# Altium schematic sheet AD8367.SchDoc
size A4
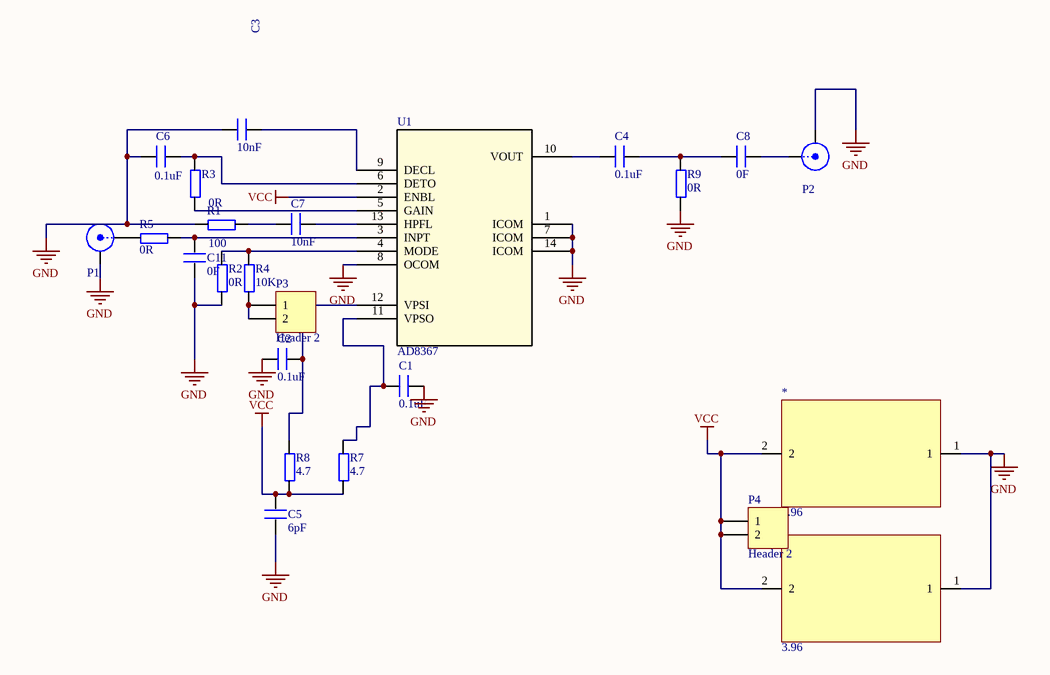
[diagram p0: AD8367.SchDoc]

## Parts
1  3.96  [3.96]
*  3.96  [3.96]
C1  0.1uF  [0603C]
C2  0.1uF  [0603C]
C3  10nF  [0603C]
C4  0.1uF  [0603C]
C5  6pF  [C 0805_M]
C6  0.1uF  [0603C]
C7  10nF  [0603C]
C8  0F  [0603C]
C11  0F  [0603C]
P1  SMA  [SMA-V]  (value not drawn)
P2  SMA  [SMA-V]  (value not drawn)
P3  Header 2  [HDR1X2]
P4  Header 2  [HDR1X2]
R1  100  [0603R]
R2  0R  [0603R]
R3  0R  [0603R]
R4  10K  [0603R]
R5  0R  [0603R]
R7  4.7  [0603R]
R8  4.7  [0603R]
R9  0R  [0603R]
U1  AD8367  [RU_14]

## Nets
GND: 1.1 *.1 C1.1 C2.2 C3.1 C5.1 C6.1 C11.2 P1.2(Y) P2.2(Y) R1.1 R2.1 R9.1 U1.1(ICOM) U1.7(ICOM) U1.8(OCOM) U1.14(ICOM)
VCC: 1.2 *.2 C5.2 P4.1 P4.2 R7.1 R8.1 U1.2(ENBL)
NetC1_2: C1.2 R7.2 U1.11(VPSO)
NetC2_1: C2.1 R8.2 U1.12(VPSI)
NetC3_2: C3.2 U1.9(DECL)
NetC4_1: C4.1 U1.10(VOUT)
NetC4_2: C4.2 C8.1 R9.2
NetC6_2: C6.2 R3.2 U1.6(DETO)
NetC7_1: C7.1 R1.2
NetC7_2: C7.2 U1.13(HPFL)
NetC8_2: C8.2 P2.1(X)
NetC11_1: C11.1 R5.2 U1.3(INPT)
NetP1_1: P1.1(X) R5.1
NetP3_1: P3.1 P3.2 R4.1
NetR2_2: R2.2 R4.2 U1.4(MODE)
NetR3_1: R3.1 U1.5(GAIN)

## Library data of the parts
C1-C8 C11 = C: Capacitor
P1 P2 = SMA: SMA Connector
P3 P4 = Header 2: Header, 2-Pin; LatestRevisionDate: 17-Jul-2002; LatestRevisionNote: Re-released for DXP Platform.; Publisher: Altium Limited
R1-R5 R7-R9 = Resistor
U1 = AD8367: 500 MHz 、45dB线性dB可变增益放大器; Manufacturer_Part_Number: AD8367ARUZ; Built_By: EMA_UL_Team; Vendor: Analog Devices Inc; Copyright: Copyright (C) 2018 Accelerated Designs. All rights reserved; RefDes: RefDes; Type: DEV; Value: Value